# Altium schematic sheet Raspberry_Pwr.SchDoc
size A3; SheetNumber: 10; SheetTotal: 13
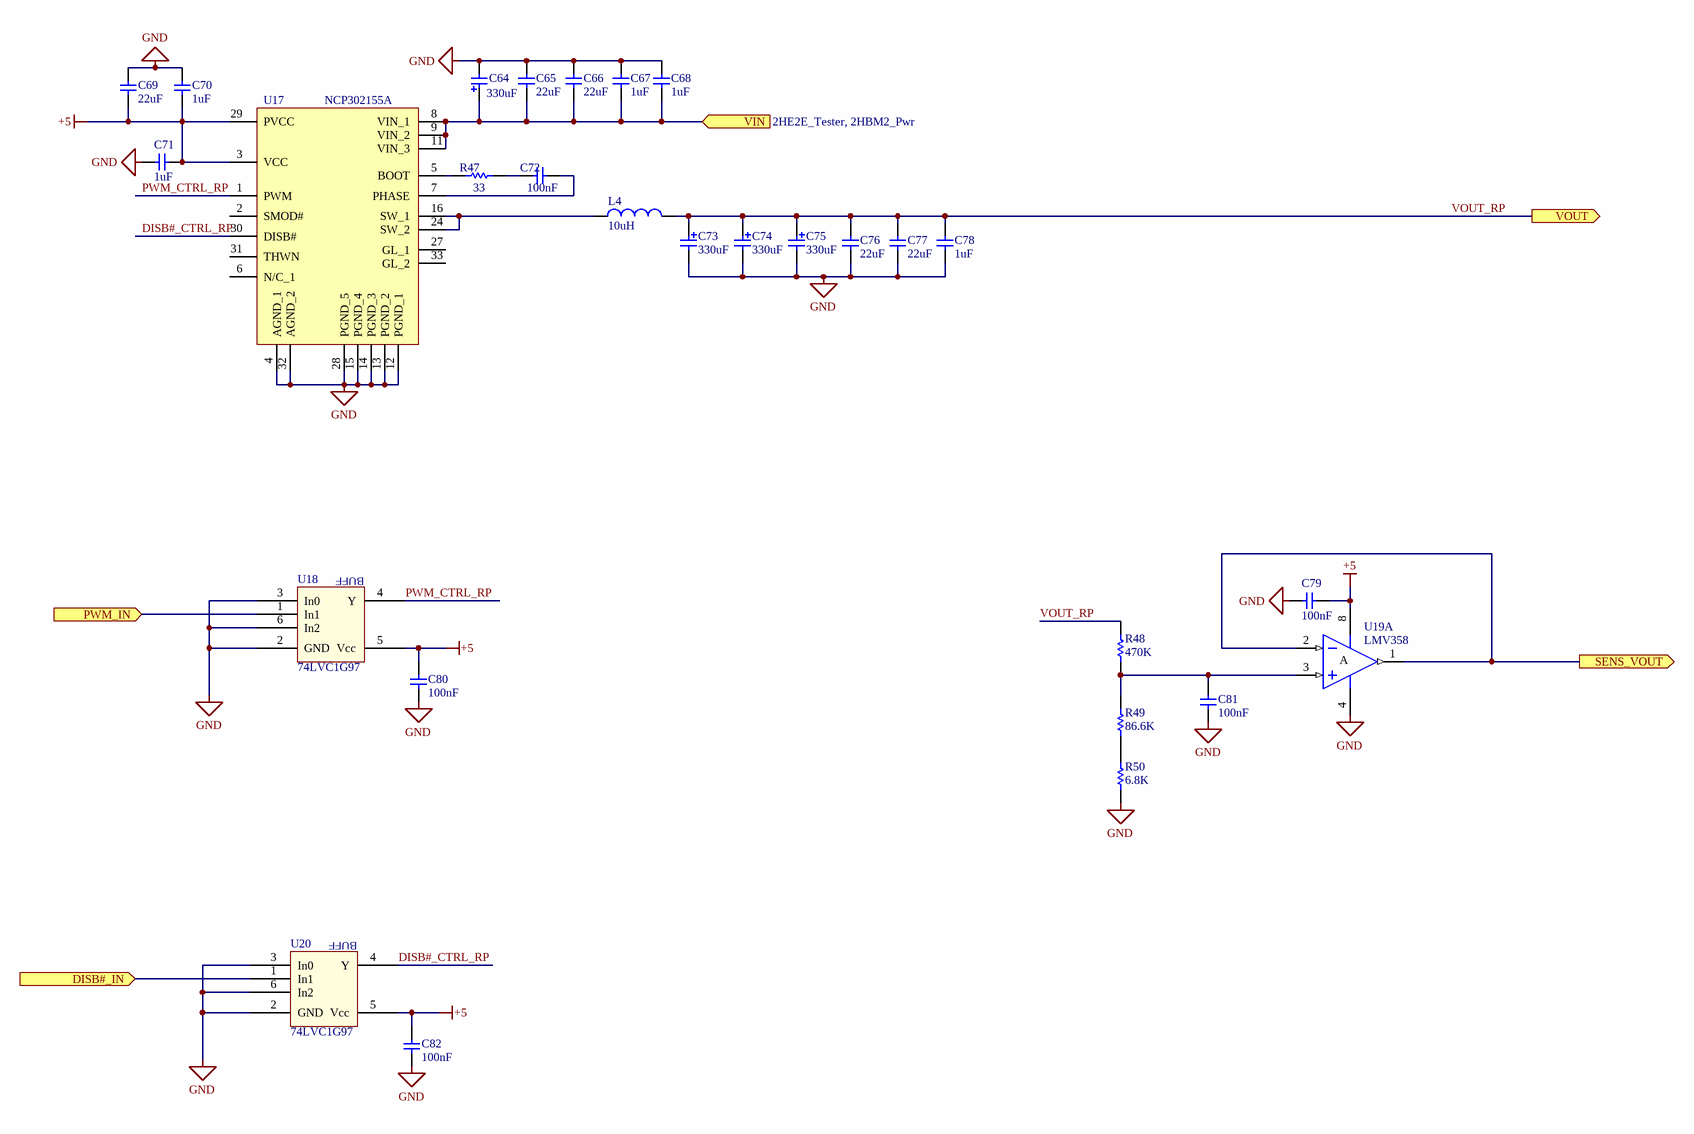
[diagram p0: Raspberry_Pwr.SchDoc]

## Parts
C64  value 330uF  [Cap Elet SMD 8.0 mm CASE E-h6.5mm]  (hidden comment: Cap Elettrolitico)
C65  value 22uF  [1206M]  (hidden comment: Cap Ceramic)
C66  value 22uF  [1206M]  (hidden comment: Cap Ceramic)
C67  value 1uF  [1206M]  (hidden comment: Cap Ceramic)
C68  value 1uF  [1206M]  (hidden comment: Cap Ceramic)
C69  value 22uF  [1206M]  (hidden comment: Cap Ceramic)
C70  value 1uF  [1206M]  (hidden comment: Cap Ceramic)
C71  value 1uF  [1206M]  (hidden comment: Cap Ceramic)
C72  value 100nF  [0603M-C]  (hidden comment: Cap Ceramic)
C73  value 330uF  [Cap Elet SMD 8.0 mm CASE E-h6.5mm]  (hidden comment: Cap Elettrolitico)
C74  value 330uF  [Cap Elet SMD 8.0 mm CASE E-h6.5mm]  (hidden comment: Cap Elettrolitico)
C75  value 330uF  [Cap Elet SMD 8.0 mm CASE E-h6.5mm]  (hidden comment: Cap Elettrolitico)
C76  value 22uF  [1206M]  (hidden comment: Cap Ceramic)
C77  value 22uF  [1206M]  (hidden comment: Cap Ceramic)
C78  value 1uF  [1206M]  (hidden comment: Cap Ceramic)
C79  value 100nF  [0603M]  (hidden comment: Cap Ceramic)
C80  value 100nF  [0603M]  (hidden comment: Cap Ceramic)
C81  value 100nF  [0603M]  (hidden comment: Cap Ceramic)
C82  value 100nF  [0603M]  (hidden comment: Cap Ceramic)
L4  value 10uH  [WE-HCC_1210]  (hidden comment: Induttanza)
R47  value 33  [0603M]  (hidden comment: Resistor)
R48  value 470K  [0603M]  (hidden comment: Resistor)
R49  value 86.6K  [0603M]  (hidden comment: Resistor)
R50  value 6.8K  [0603M]  (hidden comment: Resistor)
U17  NCP302155A  [NCP302155A]
U18  74LVC1G97  [TSOP65P211-6N]
U19  LMV358  [SOIC127P600-8N]  (part A of 2)
U20  74LVC1G97  [TSOP65P211-6N]

## Ports
DISB#_IN (in, see 2HE2E_Tester), PWM_IN (in, see 2HE2E_Tester), SENS_VOUT (out, see 2HE2E_Tester), VIN (in, see 2HE2E_Tester, 2HBM2_Pwr), VOUT (out, see 2HE2E_Tester)

## Nets
+5: C69.2 C70.1 C71.1 C79.2 C80.2 C82.2 U17.3(VCC) U17.29(PVCC) U18.5(Vcc) U19.8(V+) U20.5(Vcc)
GND: C64.2 C65.2 C66.2 C67.2 C68.2 C69.1 C70.2 C71.2 C73.2 C74.2 C75.2 C76.2 C77.2 C78.2 C79.1 C80.1 C81.1 C82.1 R50.1 U17.4(AGND_1) U17.12(PGND_1) U17.13(PGND_2) U17.14(PGND_3) U17.15(PGND_4) U17.28(PGND_5) U17.32(AGND_2) U18.2(GND) U18.3(In0) U18.6(In2) U19.4(GND) U20.2(GND) U20.3(In0) U20.6(In2)
DISB#_CTRL_RP: U17.30(DISB#) U20.4(Y)
DISB#_IN: U20.1(In1) ; port DISB#_IN
PWM_CTRL_RP: U17.1(PWM) U18.4(Y)
PWM_IN: U18.1(In1) ; port PWM_IN
SENS_VOUT: U19.1(OUT) U19.2(IN-) ; port SENS_VOUT
VIN: C64.1 C65.1 C66.1 C67.1 C68.1 U17.8(VIN_1) U17.9(VIN_2) U17.11(VIN_3) ; port VIN
VOUT_RP: C73.1 C74.1 C75.1 C76.1 C77.1 C78.1 L4.2 R48.2 ; port VOUT
NetC72_1: C72.1 R47.2
NetC72_2: C72.2 U17.7(PHASE)
NetC81_2: C81.2 R48.1 R49.2 U19.3(IN+)
NetL4_1: L4.1 U17.16(SW_1) U17.24(SW_2)
NetR47_1: R47.1 U17.5(BOOT)
NetR49_1: R49.1 R50.2

Not connected (* = marked no-connect by the designer): U17 2(SMOD#) 6(N/C_1) 27(GL_1) 31(THWN) 33(GL_2)

## Notes on the sheet
- (near U18) BUFF
- (near U20) BUFF
- Title
- Size:
- Date:
- A4
- Number:
- Time:
- Revision:
- Sheet
- of
- File:
- (in symbol LMV358, part A) A

## Library data of the parts
C64 C73-C75 = Cap Elettrolitico: Condensatore elettrolitico 35V D8
C65 C66 C69 C76 C77 C79-C82 = Cap Ceramic: Ceramic Capacitor 25V
C67 C68 C70 C71 C78 = Cap Ceramic: Ceramic Capacitor 50V
C72 = Cap Ceramic: Ceramic Capacitor
L4 = Induttanza: WE 7443321000
U17 = NCP302155A: Integrated Driver and MOSFET
U18 U20 = 74LVC1G97: Logic gate configurabile
U19 = LMV358: Dual Operational Amplifier Single Supply Rail to Rail; DatasheetDocument: Jan-1999; PackageDocument: Jul-1998; Publisher: Altium Limited; Code_JEDEC: MS-012-AA; Code_IPC: SO8; ComponentLink1Description: Manufacturer Link; ComponentLink1URL: http://www.st.com/; ComponentLink2Description: Datasheet; ComponentLink2URL: http://www.st.com/stonline/products/literature/ds/2300/tl082.pdf